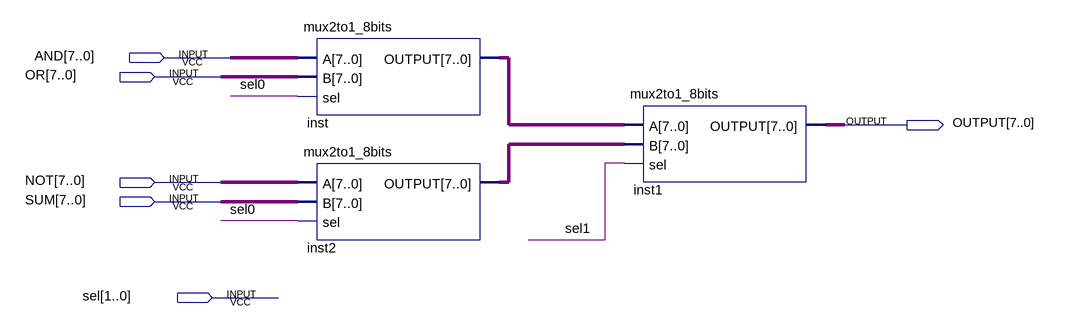
[diagram p0: schematic sheet]
// Quartus schematic mux4to1_8bits.bdf as structural Verilog: 3 symbols, 6 pins
module mux4to1_8bits (
  input  [7:0] AND,
  input  [7:0] OR,
  input  [7:0] NOT,
  input  [7:0] SUM,
  input  [1:0] sel,
  output [7:0] OUTPUT
);

  wire [7:0] inst2_output, inst_output;

  mux2to1_8bits inst (.A(AND), .B(OR), .sel(sel[0]), .OUTPUT(inst_output));
  mux2to1_8bits inst2 (.A(NOT), .B(SUM), .sel(sel[0]), .OUTPUT(inst2_output));
  mux2to1_8bits inst1 (.A(inst_output), .B(inst2_output), .sel(sel[1]), .OUTPUT(OUTPUT));
endmodule
